# EAGLE design booz_imu_h (EAGLE 6.1)
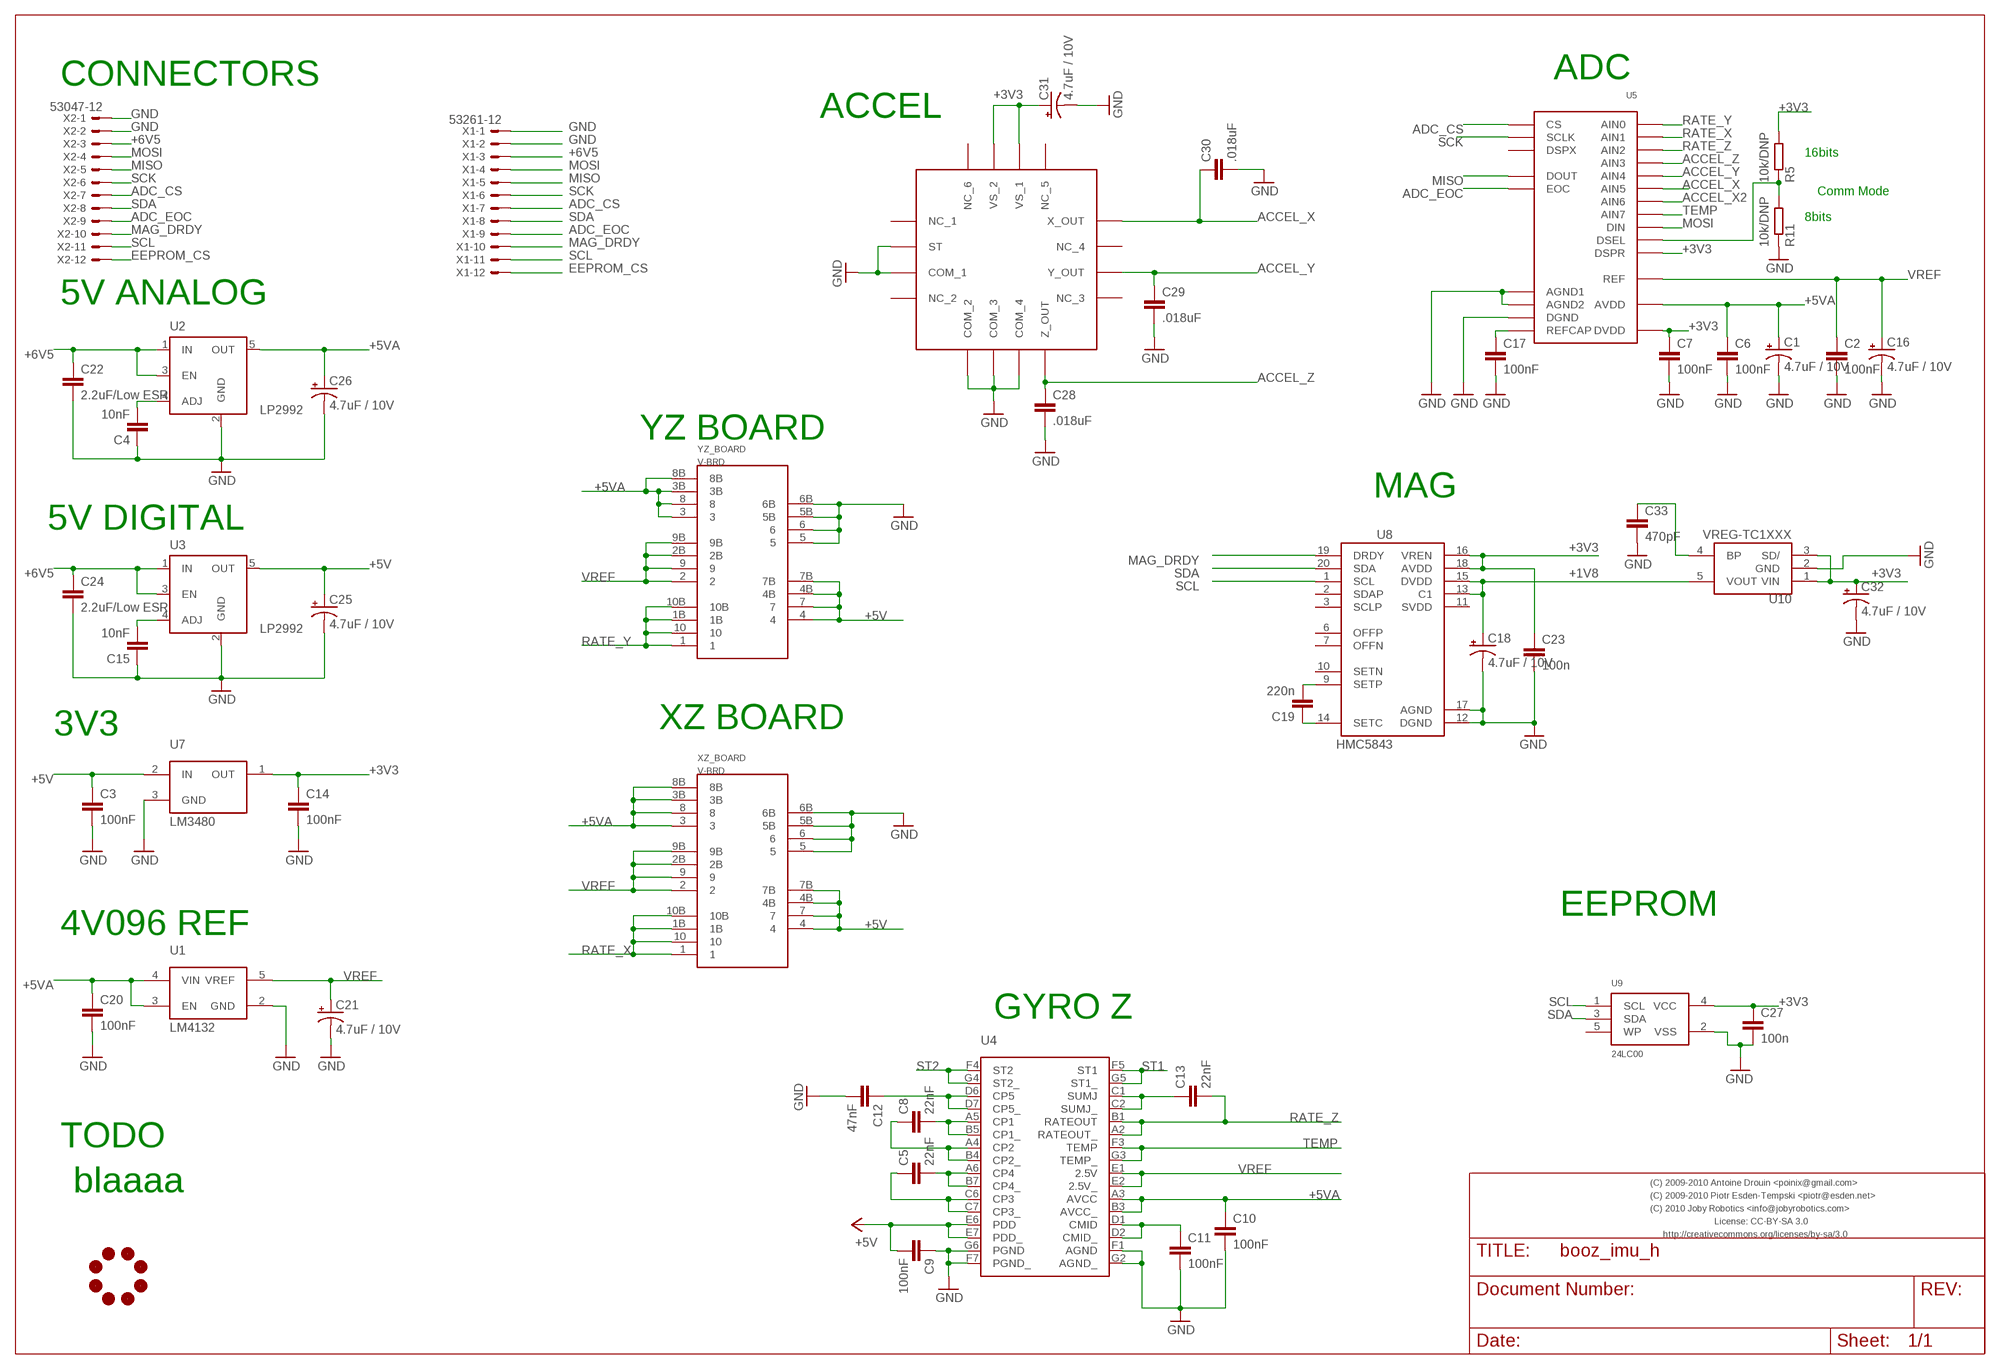
[diagram p0: schematic, sheet 1]

## Parts
C1  4.7uF / 10V  CPOL-US  [CAP_0805TANT_F95]
C2  100nF  CAPACITOR-0603  [0603-CAP]
C3  100nF  CAPACITOR-0603  [0603-CAP]
C4  10nF  CAPACITOR-0603  [0603-CAP]
C5  22nF  CAPACITOR-0603  [0603-CAP]
C6  100nF  CAPACITOR-0603  [0603-CAP]
C7  100nF  CAPACITOR-0603  [0603-CAP]
C8  22nF  CAPACITOR-0603  [0603-CAP]
C9  100nF  CAPACITOR-0603  [0603-CAP]
C10  100nF  CAPACITOR-0603  [0603-CAP]
C11  100nF  CAPACITOR-0603  [0603-CAP]
C12  47nF  CAPACITOR-0603  [0603-CAP]
C13  22nF  CAPACITOR-0603  [0603-CAP]
C14  100nF  CAPACITOR-0603  [0603-CAP]
C15  10nF  CAPACITOR-0603  [0603-CAP]
C16  4.7uF / 10V  CPOL-US  [CAP_0805TANT_F95]
C17  100nF  CAPACITOR-0603  [0603-CAP]
C18  4.7uF / 10V  CPOL-US  [CAP_0805TANT_F95]
C19  220n  CAPACITOR-0603  [0603-CAP]
C20  100nF  CAPACITOR-0603  [0603-CAP]
C21  4.7uF / 10V  CPOL-US  [CAP_0805TANT_F95]
C22  2.2uF/Low ESR  CAPACITOR-0603  [0603-CAP]
C23  100n  CAPACITOR-0603  [0603-CAP]
C24  2.2uF/Low ESR  CAPACITOR-0603  [0603-CAP]
C25  4.7uF / 10V  CPOL-US  [CAP_0805TANT_F95]
C26  4.7uF / 10V  CPOL-US  [CAP_0805TANT_F95]
C27  100n  CAPACITOR-0603  [0603-CAP]
C28  .018uF  CAPACITOR-0603  [0603-CAP]
C29  .018uF  CAPACITOR-0603  [0603-CAP]
C30  .018uF  CAPACITOR-0603  [0603-CAP]
C31  4.7uF / 10V  CPOL-US  [CAP_0805TANT_F95]
C32  4.7uF / 10V  CPOL-US  [CAP_0805TANT_F95]
C33  470pF  CAPACITOR-0603  [0603-CAP]
JL1  JOBY_LOGO-6MIL  [JOBY_LOGO_6MIL]
R5  10k/DNP  RESISTOR-0603  [0603-RES]
R11  10k/DNP  RESISTOR-0603  [0603-RES]
U1  LM4132  [SOT23-5L]
U2  LP2992  MIC5219BM5  [SOT23-5]
U3  LP2992  MIC5219BM5  [SOT23-5]
U4  ADXR  [BC-32]
U5  MAX1168  [QSOP24]
U6  ADXL335  [LFCSP_LQ16]
U7  LM3480  [SOT23]
U8  HMC5843  [LPCC20-HMC5843]
U9  24LC00  I2C_EEPROM-SOT23-5  [SOT23-5]
U10  VREG-TC1XXX  [SOT23-5]
X1  53261-12  [53261-12]
X2  53047-12  [53047-12]
XZ_BOARD  V-BRD  [V-BRD]
YZ_BOARD  V-BRD  [V-BRD]

## Nets
+1V8: C18.P$1(+) U8.13(C1) U8.15(DVDD) U10.5(VOUT)
+3V3: C7.P$1 C14.P$1 C23.P$1 C27.P$1 C31.P$1(+) C32.P$1(+) R5.P$2 U5.P$1(DSPR) U5.P$22(DVDD) U6.P$14(VS_1) U6.P$15(VS_2) U7.1(OUT) U8.16(VREN) U8.18(AVDD) U9.4(VCC) U10.1(VIN) U10.3(SD/)
+5V: C3.P$1 C9.P$2 C25.P$1(+) U3.5(OUT) U4.E6(PDD) U4.E7(PDD_) U7.2(IN) XZ_BOARD.4 XZ_BOARD.4B XZ_BOARD.7 XZ_BOARD.7B YZ_BOARD.4 YZ_BOARD.4B YZ_BOARD.7 YZ_BOARD.7B
+5VA: C1.P$1(+) C6.P$1 C10.P$1 C20.P$1 C26.P$1(+) U1.3(EN) U1.4(VIN) U2.5(OUT) U4.A3(AVCC) U4.B3(AVCC_) U5.P$19(AVDD) XZ_BOARD.3 XZ_BOARD.3B XZ_BOARD.8 XZ_BOARD.8B YZ_BOARD.3 YZ_BOARD.3B YZ_BOARD.8 YZ_BOARD.8B
+6V5: C22.P$1 C24.P$1 U2.1(IN) U2.3(EN) U3.1(IN) U3.3(EN) X1.3 X2.3
ACCEL_X: C30.P$1 U5.P$12(AIN5) U6.P$12(X_OUT)
ACCEL_X2: U5.P$13(AIN6)
ACCEL_Y: C29.P$1 U5.P$11(AIN4) U6.P$10(Y_OUT)
ACCEL_Z: C28.P$1 U5.P$10(AIN3) U6.P$8(Z_OUT)
ADC_CS: U5.P$20(CS) X1.7 X2.7
ADC_EOC: U5.P$6(EOC) X1.9 X2.9
EEPROM_CS: X1.12 X2.12
GND: C1.P$2(-) C2.P$2 C3.P$2 C4.P$1 C6.P$2 C7.P$2 C9.P$1 C10.P$2 C11.P$2 C12.P$2 C14.P$2 C15.P$1 C16.P$2(-) C17.P$2 C18.P$2(-) C20.P$2 C21.P$2(-) C22.P$2 C23.P$2 C24.P$2 C25.P$2(-) C26.P$2(-) C27.P$2 C28.P$2 C29.P$2 C30.P$2 C31.P$2(-) C32.P$2(-) C33.P$2 R11.P$1 U1.2(GND) U2.2(GND) U3.2(GND) U4.F1(AGND) U4.F7(PGND_) U4.G2(AGND_) U4.G6(PGND) U5.P$17(AGND1) U5.P$18(AGND2) U5.P$21(DGND) U6.P$2(ST) U6.P$3(COM_1) U6.P$5(COM_2) U6.P$6(COM_3) U6.P$7(COM_4) U7.3(GND) U8.12(DGND) U8.17(AGND) U9.2(VSS) U10.2(GND) X1.1 X1.2 X2.1 X2.2 XZ_BOARD.5 XZ_BOARD.5B XZ_BOARD.6 XZ_BOARD.6B YZ_BOARD.5 YZ_BOARD.5B YZ_BOARD.6 YZ_BOARD.6B
MAG_DRDY: U8.19(DRDY) X1.10 X2.10
MISO: U5.P$3(DOUT) X1.5 X2.5
MOSI: U5.P$5(DIN) X1.4 X2.4
N$1: R5.P$1 R11.P$2 U5.P$2(DSEL)
N$3: C17.P$1 U5.P$16(REFCAP)
N$5: C33.P$1 U10.4(BP)
N$7: C5.P$2 U4.A6(CP4) U4.B7(CP4_)
N$8: C5.P$1 U4.C6(CP3) U4.C7(CP3_)
N$9: C8.P$2 U4.A5(CP1) U4.B5(CP1_)
N$10: C8.P$1 U4.A4(CP2) U4.B4(CP2_)
N$11: C13.P$1 U4.C1(SUMJ) U4.C2(SUMJ_)
N$12: C12.P$1 U4.D6(CP5) U4.D7(CP5_)
N$13: C11.P$1 U4.D1(CMID) U4.D2(CMID_)
N$15: C19.P$2 U8.9(SETP)
N$19: C15.P$2 U3.4(ADJ)
N$23: C4.P$2 U2.4(ADJ)
N$48: C19.P$1 U8.14(SETC)
RATE_X: U5.P$8(AIN1) XZ_BOARD.1 XZ_BOARD.1B XZ_BOARD.10 XZ_BOARD.10B
RATE_Y: U5.P$7(AIN0) YZ_BOARD.1 YZ_BOARD.1B YZ_BOARD.10 YZ_BOARD.10B
RATE_Z: C13.P$2 U4.A2(RATEOUT_) U4.B1(RATEOUT) U5.P$9(AIN2)
SCK: U5.P$4(SCLK) X1.6 X2.6
SCL: U8.1(SCL) U9.1(SCL) X1.11 X2.11
SDA: U8.20(SDA) U9.3(SDA) X1.8 X2.8
ST1: U4.F5(ST1) U4.G5(ST1_)
ST2: U4.F4(ST2) U4.G4(ST2_)
TEMP: U4.F3(TEMP) U4.G3(TEMP_) U5.P$14(AIN7)
VREF: C2.P$1 C16.P$1(+) C21.P$1(+) U1.5(VREF) U4.E1(2.5V) U4.E2(2.5V_) U5.P$15(REF) XZ_BOARD.2 XZ_BOARD.2B XZ_BOARD.9 XZ_BOARD.9B YZ_BOARD.2 YZ_BOARD.2B YZ_BOARD.9 YZ_BOARD.9B
Unconnected: U5.P$23(DSPX) U6.P$1(NC_1) U6.P$4(NC_2) U6.P$9(NC_3) U6.P$11(NC_4) U6.P$13(NC_5) U6.P$16(NC_6) U8.2(SDAP) U8.3(SCLP) U8.6(OFFP) U8.7(OFFN) U8.10(SETN) U8.11(SVDD) U9.5(WP)

## Notes on the sheet
- CONNECTORS | ADC
- ACCEL
- 16bits
- Comm Mode
- 8bits
- 5V ANALOG
- YZ BOARD
- MAG
- 5V DIGITAL
- 3V3 | XZ BOARD
- EEPROM
- 4V096 REF
- GYRO Z
- TODO
- (C) 2009-2010 Antoine Drouin <poinix@gmail.com>
- blaaaa
- (C) 2009-2010 Piotr Esden-Tempski <piotr@esden.net>
- (C) 2010 Joby Robotics <info@jobyrobotics.com>
- License: CC-BY-SA 3.0
- http://creativecommons.org/licenses/by-sa/3.0

## Library data of the parts
C1 C16 C18 C21 C25 C26 C31 C32 = booz_imu_h:CPOL-US: POLARIZED CAPACITOR, American symbol
C2-C15 C17 C19 C20 C22-C24 C27-C30 C33 = pel_dipol_comp:CAPACITOR
JL1 = aspirin:JOBY_LOGO
R5 R11 = pel_dipol_comp:RESISTOR
U1 = booz:LM4132: Precision LDO Voltage Reference
U2 U3 = v-reg-micrel:MIC5219BM5: VOLTAGE REGULATOR
U4 = paparazzi:ADXR
U5 = booz:MAX1168
U6 = joby_robotics:ADXL335
U7 = booz:LM3480
U8 = omc:HMC5843: Honeywell HMC5843 - 3-Axis Digital Magnetometer - 3-Axis Magnetoresistive Sensors and ASIC in a Single Package - Low Voltage Operations (2.5 to 3.3V) - I2C Interface
U9 = aspirin:I2C_EEPROM
U10 = booz_imu_h:VREG-TC1XXX
X1 X2 = con-molex:53?-12: CONNECTOR wire to board 1.25 mm (.049 inch) pitch header
XZ_BOARD YZ_BOARD = booz_imu_h:V-BRD

## Board
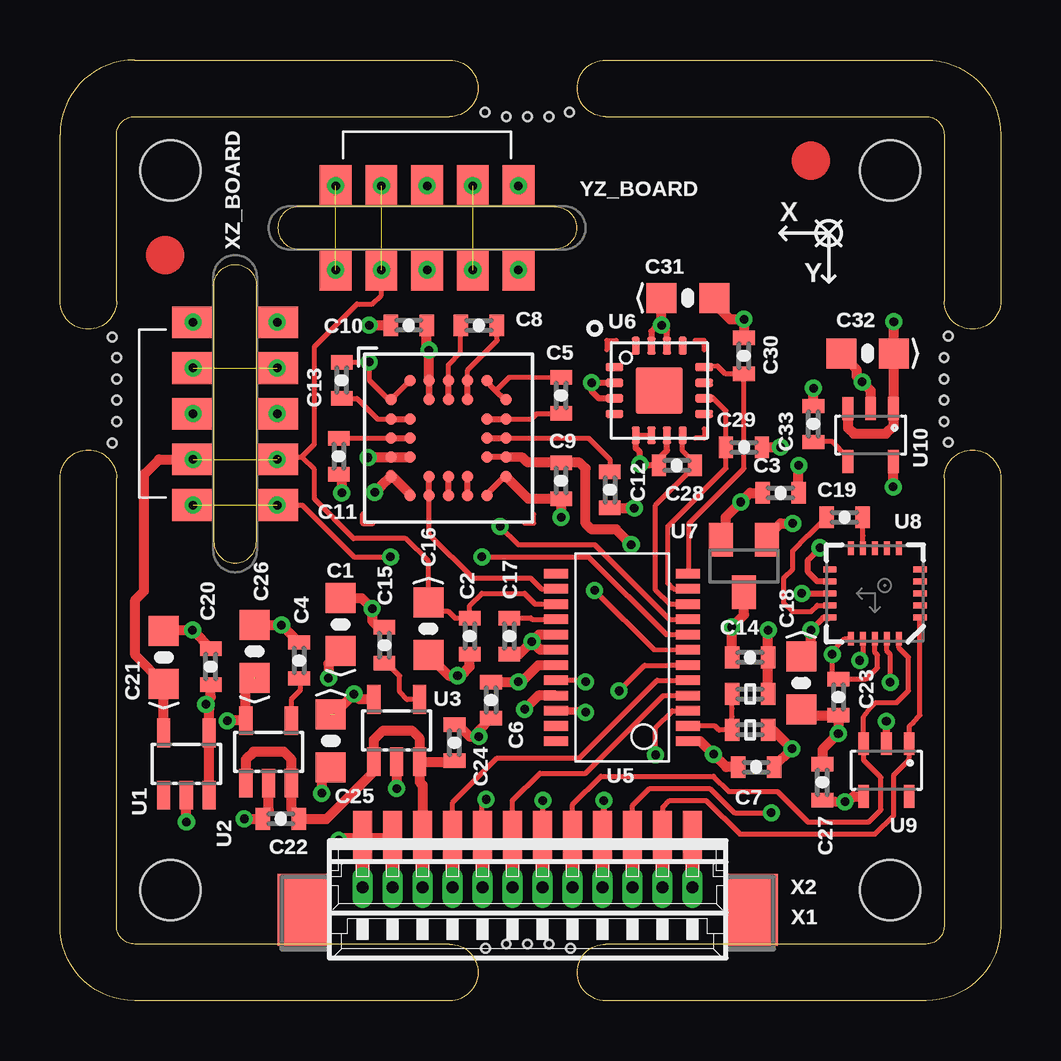
[diagram p1: board, top side]
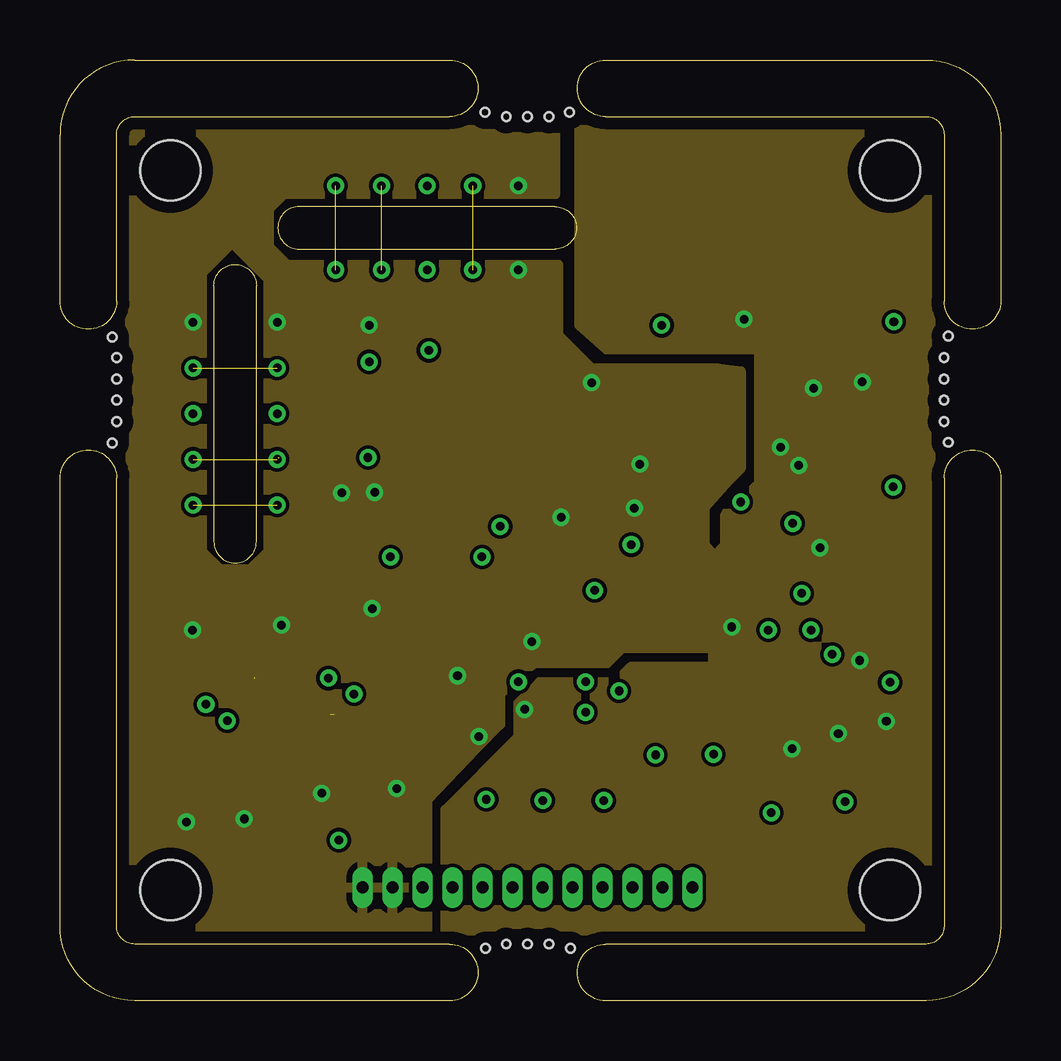
[diagram p2: board, inner layer Route2]
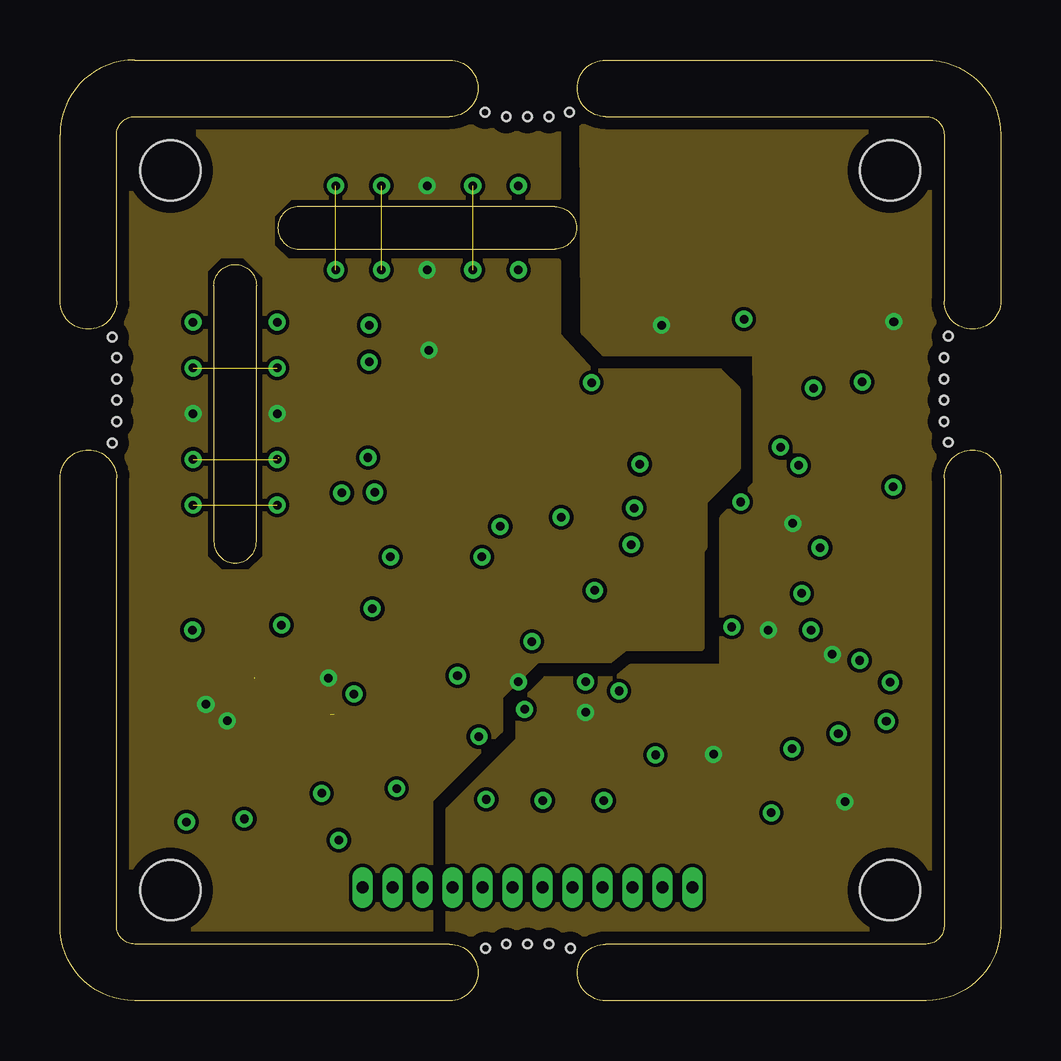
[diagram p3: board, inner layer Route15]
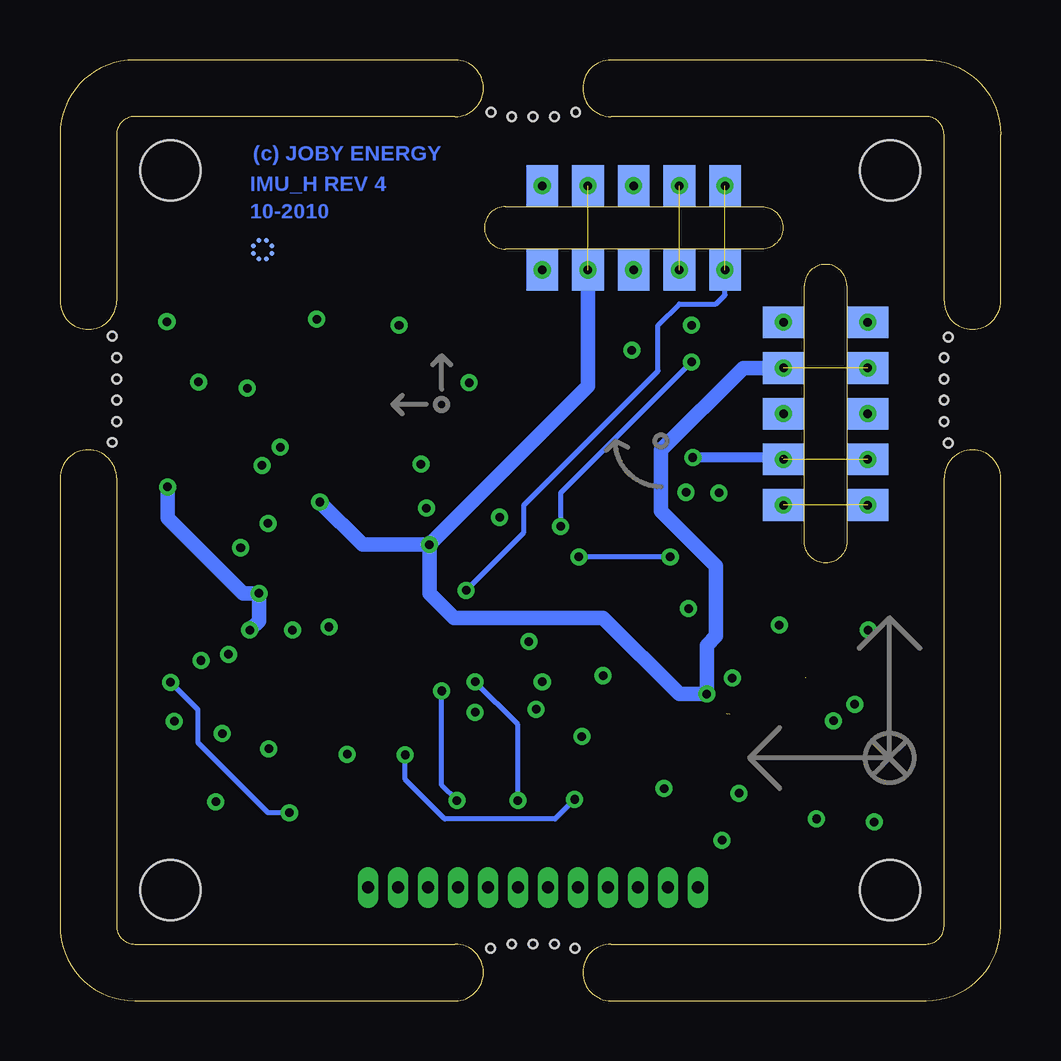
[diagram p4: board, bottom side, seen from below]

Size 39.22 x 39.22 mm. Coordinates in mm from the lower left corner, seen from the top.
Outline: 3.11,36.85 16.24,36.85 arc180 16.24,39.22 3.11,39.22 arc90 0,36.11 0,29.17 arc180 2.36,29.17 2.36,36.11 arc-90 3.11,36.85
Outline: 22.75,36.85 36.11,36.85 arc-90 36.86,36.11 36.86,29.17 arc180 39.22,29.17 39.22,36.11 arc90 36.11,39.22 22.75,39.22 arc180 22.75,36.85
Outline: 36.86,21.78 36.86,3.11 arc-90 36.11,2.36 22.75,2.36 arc180 22.75,0 36.11,0 arc90 39.22,3.11 39.22,21.78 arc180 36.86,21.78
Outline: 16.24,2.36 3.11,2.36 arc-90 2.36,3.11 2.36,21.78 arc180 0,21.78 0,3.11 arc90 3.11,0 16.24,0 arc180 16.24,2.36
Copper layers (1*2+15*16): Top 0.035mm / dielectric 0.2mm / Route2 0.035mm / dielectric 1.5mm / Route15 0.035mm / dielectric 0.2mm / Bottom 0.035mm
Design rules: minimum track width 0.15mm, minimum drill 0.35mm, track to track 0.15mm, track to pad 0.15mm, pad to pad 0.15mm, via to via 0.15mm, smd to smd 0.15mm, copper to edge 20mil, drill to drill 8mil, minimum pad ring 0.177mm, minimum via ring 0.177mm, stop-mask expansion 4mil, vias tented up to drill 14mil, thermal gap 10mil
Holes 2.5 mm at 4.61,34.61 34.61,34.61 34.61,4.61 4.61,4.61
Holes 0.36 mm at 2.36,24.14 2.18,27.67 2.18,23.25 36.86,24.14 37.03,23.28 37.03,27.7 19.49,2.36 17.74,2.18 21.27,2.18 19.49,36.86 21.25,37.03 17.72,37.03 2.36,25.03 2.36,25.92 2.36,26.81 36.86,25.03 36.86,25.92 36.86,26.81 20.38,36.86 18.61,36.86 20.38,2.36 18.61,2.36
tKeepout: area 2.1,32.1 to 7.1,37.1; area 32.1,32.1 to 37.1,37.1; area 2.1,2.1 to 7.1,7.1; area 32.1,2.1 to 37.1,7.1

### Footprints (pad centres in the part's own frame; a part is rotated, then mirrored left to right if it is on the bottom)
CAP_0805TANT_F95 = smd 1.25 x 1.25: P$1 -1.1,0; P$2 1.1,0
0603-CAP = smd 0.6 x 0.9: P$1 -0.75,0; P$2 0.75,0
JOBY_LOGO_6MIL = smd 0.203 x 0.203: 1 -0.152,0.381; 2 0.152,0.381; 3 0.381,0.152; 4 0.381,-0.152; 5 0.152,-0.381; 6 -0.152,-0.381; 7 -0.381,-0.152; 8 -0.381,0.152
0603-RES = smd 0.6 x 0.9: P$1 -0.75,0; P$2 0.75,0
SOT23-5L = smd 0.55 x 1.2: 1 -0.95,-1.3; 2 0,-1.3; 3 0.95,-1.3; 4 0.95,1.3; 5 -0.95,1.3
SOT23-5 = smd 0.55 x 1.2: 1 -0.95,-1.3; 2 0,-1.3; 3 0.95,-1.3; 4 0.95,1.3; 5 -0.95,1.3
BC-32 = smd 0.48 x 0.48: A2 -1.6,2.4; A3 -0.8,2.4; A4 0,2.4; A5 0.8,2.4; A6 1.6,2.4; B1 -2.4,1.6; B3 -0.8,1.6; B4 0,1.6; B5 0.8,1.6; B7 2.4,1.6; C1 -2.4,0.8; C2 -1.6,0.8; C6 1.6,0.8; C7 2.4,0.8; D1 -2.4,0; D2 -1.6,0; D6 1.6,0; D7 2.4,0; E1 -2.4,-0.8; E2 -1.6,-0.8; E6 1.6,-0.8; E7 2.4,-0.8; F1 -2.4,-1.6; F3 -0.8,-1.6; F4 0,-1.6; F5 0.8,-1.6; F7 2.4,-1.6; G2 -1.6,-2.4; G3 -0.8,-2.4; G4 0,-2.4; G5 0.8,-2.4; G6 1.6,-2.4
QSOP24 = smd 0.4 x 1: P$1 -3.493,-2.75; P$2 -2.857,-2.75; P$3 -2.223,-2.75; P$4 -1.587,-2.75; P$5 -0.953,-2.75; P$6 -0.318,-2.75; P$7 0.318,-2.75; P$8 0.953,-2.75; P$9 1.587,-2.75; P$10 2.223,-2.75; P$11 2.857,-2.75; P$12 3.493,-2.75; P$13 3.493,2.75; P$14 2.857,2.75; P$15 2.223,2.75; P$16 1.587,2.75; P$17 0.953,2.75; P$18 0.318,2.75; P$19 -0.318,2.75; P$20 -0.953,2.75; P$21 -1.587,2.75; P$22 -2.223,2.75; P$23 -2.857,2.75; P$24 -3.493,2.75
LFCSP_LQ16 = smd 0.75 x 0.35: P$1 -1.869,0.975; P$2 -1.869,0.325; P$3 -1.869,-0.325; P$4 -1.869,-0.975; P$9 1.869,-0.975; P$10 1.869,-0.325; P$11 1.869,0.325; P$12 1.869,0.975 | smd 0.35 x 0.75: P$5 -0.975,-1.869; P$6 -0.325,-1.869; P$7 0.325,-1.869; P$8 0.975,-1.869; P$13 0.975,1.869; P$14 0.325,1.869; P$15 -0.325,1.869; P$16 -0.975,1.869 | smd 1.95 x 1.95: P$17 0,0
SOT23 = smd 1 x 1.4: 1 -0.95,-1.1; 2 0.95,-1.1; 3 0,1.1
LPCC20-HMC5843 = smd 0.25 x 0.56: 1 1,1.88; 2 0.5,1.88; 3 0,1.88; 4 -0.5,1.88; 5 -1,1.88; 11 -1,-1.88; 12 -0.5,-1.88; 13 0,-1.88; 14 0.5,-1.88; 15 1,-1.88 | smd 0.56 x 0.25: 6 -1.88,1; 7 -1.88,0.5; 8 -1.88,0; 9 -1.88,-0.5; 10 -1.88,-1; 16 1.88,-1; 17 1.88,-0.5; 18 1.88,0; 19 1.88,0.5; 20 1.88,1
SOT23-5' = smd 0.45 x 0.95: 1 0.95,1.1; 2 0,1.1; 3 -0.95,1.1; 4 -0.95,-1.1; 5 0.95,-1.1
53261-12 = smd 0.8 x 2: 1 6.875,-2.5; 2 5.625,-2.5; 3 4.375,-2.5; 4 3.125,-2.5; 5 1.875,-2.5; 6 0.625,-2.5; 7 -0.625,-2.5; 8 -1.875,-2.5; 9 -3.125,-2.5; 10 -4.375,-2.5; 11 -5.625,-2.5; 12 -6.875,-2.5 | smd 2.1 x 3: S1 9.375,0.625; S2 -9.375,0.625
53047-12 = drill 0.5 pad 0.698 long: 1 6.875,0.45; 2 5.625,0.45; 3 4.375,0.45; 4 3.125,0.45; 5 1.875,0.45; 6 0.625,0.45; 7 -0.625,0.45; 8 -1.875,0.45; 9 -3.125,0.45; 10 -4.375,0.45; 11 -5.625,0.45; 12 -6.875,0.45
V-BRD = smd 1.321 x 1.727: 1 -3.81,-1.753; 2 -1.905,-1.753; 3 0,-1.753; 4 1.905,-1.753; 5 3.81,-1.753; 6 3.81,1.753; 7 1.905,1.753; 8 0,1.753; 9 -1.905,1.753; 10 -3.81,1.753 | smd 1.321 x 1.727 bottom: 1B -3.81,-1.753; 2B -1.905,-1.753; 3B 0,-1.753; 4B 1.905,-1.753; 5B 3.81,-1.753; 6B 3.81,1.753; 7B 1.905,1.753; 8B 0,1.753; 9B -1.905,1.753; 10B -3.81,1.753

### Placement (x,y rotation side)
C1  11.7,15.68 90 top
C2  17.08,15.2 270 top
C3  30.04,21.17 0 top
C4  9.97,14.19 270 top
C5  20.89,25.23 90 top
C6  17.97,12.53 270 top
C7  29.02,9.74 0 top
C8  17.46,28.16 0 top
C9  20.89,21.68 90 top
C10  14.54,28.16 180 top
C11  11.62,22.69 270 top
C12  22.92,21.3 270 top
C13  11.75,25.87 90 top
C14  28.77,14.31 180 top
C15  13.53,14.82 270 top
C16  15.35,15.51 270 top
C17  18.73,15.2 270 top
C18  30.9,13.25 270 top
C19  32.7,20.15 0 top
C20  6.29,13.93 90 top
C21  4.33,14.31 90 top
C22  9.21,7.58 180 top
C23  32.45,12.66 270 top
C24  16.45,10.76 90 top
C25  11.29,10.83 270 top
C26  8.12,14.57 90 top
C27  31.78,9.11 90 top
C28  25.72,22.31 180 top
C29  28.51,23.08 0 top
C30  28.51,26.89 90 top
C31  26.17,29.3 0 top
C32  33.67,26.99 180 top
C33  31.41,24.04 90 top
JL1  30.77,31.31 0 bottom
R5  28.77,12.79 0 top
R11  28.77,11.29 180 top
U1  5.27,9.87 0 top
U2  8.7,10.38 0 top
U3  14.03,11.26 0 top
U4  16.19,23.46 0 top
U5  23.43,14.31 90 top
U6  24.98,25.44 0 top
U7  28.51,18.12 180 top
U8  33.97,16.98 270 top
U9  24LC00  [SOT23-5']  34.45,9.61 0 top
U10  VREG-TC1XXX  [SOT23-5']  33.79,23.58 0 top
X1  19.49,4.41 180 top
X2  19.49,5.17 180 top
XZ_BOARD  7.3,24.47 90 top
YZ_BOARD  15.3,32.22 0 top

### Tracks (layer width: path | path; a pad name or v marks a point on that pad's centre or on a via)
+1V8  (via drill 0.36)
  Top 0.254: v30.92,16.98 U8.13 | U8.15 32.08,15.96 31.81,15.96 v31.31,15.46
  Top 0.406: C18.P$1 30.9,14.41 31.31,14.82 v31.31,15.46 | U10.5 34.74,21.43 v34.73,21.42
  Bottom 0.61: v31.31,15.46 30.92,15.84 v30.92,16.98 31.58,16.98 34.73,20.13 v34.73,21.42
+3V3  (via drill 0.36)
  Top 0.203: U8.18 33.97,14.52 34.07,14.41 34.07,13.88 33.62,13.42 C23.P$1 32.45,13.42 32.19,13.68 v32.19,14.44 32.19,14.57 32.73,15.1 U8.16
  Top 0.254: U6.P$15 24.65,27.62 24.65,27.9 24.9,28.16 v25.08,28.16 25.16,28.09 25.17,28.09 25.31,27.95 U6.P$14
  Top 0.305: U5.P$22 21.72,12.09 v21.91,12.03
  Top 0.406: 26.16,10.82 U5.P$1 26.7,10.82 v27.24,10.27 27.77,9.74 C7.P$1 | U9.4 33.08,8.52 32.85,8.29 v32.72,8.29 32.59,8.29 C27.P$1 | U7.1 29.46,19.33 30.04,19.9 v30.54,19.9 | v29.53,15.46 29.52,15.44 C14.P$1 R5.P$2 | v25.08,28.16 25.08,29.29 C31.P$1 | U10.3 32.84,23.87 33.08,23.63 34.43,23.63 34.76,23.96 34.76,24.67 U10.1 34.77,24.68 C32.P$1 v34.77,28.3 v34.76,28.31
  pour Route15: 16.19,2.12 16.19,7.96 19.11,10.88 19.11,12.28 20.26,13.42 23.18,13.42 23.81,13.93 27.62,13.93 27.62,20.15 29.02,21.55 29.02,25.11 28.99,26.99 22.67,26.99 21.83,27.85 21.78,37.05 37.02,37.05 37.02,2.12
  pour Route15: 6.03,30.44 6.67,31.08 7.94,31.08 7.94,36.92 5.78,36.92 5.78,30.44
+5V  (via drill 0.36)  (3 unrouted)
  Top 0.254: U4.E7 U4.E6
  Top 0.406: U4.E7 19.29,22.64 19.49,22.44 C9.P$2 21.67,22.43 21.91,22.19 21.91,19.9 22.16,19.65 23.18,19.65 v23.81,19.01 | 11.43,11.96 v12.26,12.79 12.47,12.57 U3.5 | U7.2 27.56,19.46 27.75,19.65 27.75,20.15 v28.38,20.79 28.77,21.17 C3.P$1
  Bottom 0.61: v23.81,19.01 26.61,19.01 v28.38,20.79 | v23.81,19.01 17.21,25.62 YZ_BOARD.4B | v23.81,19.01 23.81,16.98 22.8,15.96 16.57,15.96 13.4,12.79 v12.26,12.79 12.26,14.82 11.87,15.2 11.87,18.12 14.16,20.41 14.16,22.95 10.73,26.38 XZ_BOARD.4B
  other vias: 9.06,26.38 5.55,26.38 17.21,30.47 17.21,33.97
+5VA  (via drill 0.36)  (1 unrouted)
  Top 0.254: U4.B3 U4.A3 15.39,25.15 15.43,25.11 U4.B3
  Top 0.406: U1.3 U1.4 6.22,12.17 v6.08,12.36 6.29,12.66 C20.P$1 | U5.P$19 19.94,13.99 19.24,13.3 v19.11,13.3 19.1,13.28 C6.P$1 | v6.97,11.67 v6.98,11.68 U2.5 7.75,13.1 C26.P$1 | 8.13,13.49 8.13,13.48 | C10.P$1 15.29,27.2 v15.38,27.11 15.39,27.1 U4.A3 | C1.P$1 11.7,14.57 11.19,14.06 v11.19,13.45
  other vias: 15.3,30.47 15.3,33.97 5.55,24.47 9.06,24.47
  pour Route15: 2.1,37.05 6.03,37.05 6.03,18.5 6.67,17.87 7.94,17.87 8.57,18.5 8.57,30.19 7.68,31.08 7.68,37.05 20.76,37.05 20.76,33.49 9.59,33.49 8.83,32.73 8.83,31.46 9.46,30.82 20.76,30.82 20.76,27.77 22.16,26.25 27.5,26.25 28.26,25.49 28.26,22.19 26.86,20.79 26.86,18.88 26.73,18.76 26.73,14.69 23.56,14.69 22.92,14.19 19.88,14.19 18.35,12.66 18.35,11.26 15.43,8.34 15.43,2.12 2.1,2.12
+6V5
  Top 0.406: U2.1 7.75,10.06 8.06,10.38 9.33,10.38 9.65,10.06 U2.3 9.65,8.01 C22.P$1 11.11,7.58 13.08,9.55 U3.1 13.09,10.89 13.47,11.26 14.67,11.26 14.98,10.95 U3.3 15,9.95 | X1.3 15.12,8.98 15,9.11 15,9.95 | 15,9.95 16.39,9.95 C24.P$1
  Top 0.61: X1.3 X2.3
ACCEL_X
  Top 0.203: U6.P$12 27.41,26.46 27.75,26.12 28,26.12 C30.P$1 28.51,26 28.52,25.98 28.51,25.88 28.51,22.19 26.23,19.9 26.23,17.85 U5.P$12
ACCEL_Y
  Top 0.203: U6.P$10 27.19,25.16 27.76,24.59 C29.P$1 27.76,22.2 25.34,19.77 25.34,17.41 25.58,17.17 U5.P$11
ACCEL_Z
  Top 0.203: U6.P$8 25.96,22.91 26.48,22.39 C28.P$1 24.83,20.66 24.83,17.11 25.4,16.53 U5.P$10
ADC_CS  (via drill 0.36)
  Top 0.203: X1.7 v20.13,8.34 | U5.P$20 21.84,13.36 v21.91,13.3
  Top 0.254: X1.7
  Top 0.61: X2.7 X1.7
  Bottom 0.203: v21.91,13.3 20.13,11.52 v20.13,8.34
ADC_EOC  (via drill 0.36)
  Top 0.203: v23.3,12.92 24.37,13.98 25.39,13.98 25.4,13.99 U5.P$6 | 22.62,4.79 22.62,7.4
  Top 0.254: 22.62,7.4 22.64,7.43 22.67,8.09 v22.67,8.34
  Top 0.61: 22.62,4.61 X2.9 22.62,4.79 X1.9
  Bottom 0.203: v22.67,8.34 23.3,8.98 v23.3,12.92
EEPROM_CS
  Top 0.61: X2.12 X1.12
GND  (via drill 0.36)
  Top 0.203: U8.17 33.47,14.32 v33.34,14.19
  Top 0.254: 17.73,21.06 17.72,21.04 | U4.G6 17.73,21.06 | 13.78,21.93 13.79,21.92 U4.F1 | 14.59,21.12 U4.G2 | 17.73,21.06 18.53,21.86 U4.F7 | C20.P$2 6.27,14.81 | U6.P$2 v22.16,25.77 22.16,25.41 22.47,25.11 U6.P$3 | U6.P$6 U6.P$5 24.01,23.03 24.17,22.87 v24.17,22.36 24.33,22.31 C28.P$2 24.98,22.33 24.98,22.62 25.31,22.94 U6.P$7 | U8.12 31.57,17.48 31.18,17.87 31.18,18.38 v31.69,18.88
  Top 0.305: U9.2 v34.45,11.65
  Top 0.406: 13.79,21.92 14.59,21.12 | v5.27,7.45 U1.2 | C20.P$2 v5.52,15.46 4.33,15.46 C21.P$2 | U2.2 8.7,7.95 C22.P$2 v7.68,7.58 | U4.F1 13.39,21.45 v13.12,21.2 | v20.89,20.15 C9.P$1 19.52,20.93 U4.F7 | C29.P$2 v30.04,23.08 | U5.P$21 19.94,12.73 v19.37,12.15 | U5.P$17 19.96,15.27 v19.67,14.97 | U5.P$18 20.02,14.63 v19.67,14.97 | C17.P$2 19.15,14.45 v19.67,14.97 | C2.P$2 17.08,13.93 16.7,13.55 v16.57,13.55 16.21,13.55 C16.P$2 | C15.P$1 13.28,15.57 13.02,15.84 v13.02,16.34 | v13.02,16.34 12.96,16.41 | C4.P$1 v9.23,15.66 v9.23,15.67 C26.P$2 | C12.P$2 23.67,20.55 v23.94,20.54 | C30.P$2 v28.51,28.41 27.93,28.41 27.27,29.06 C31.P$2 | v12.89,28.16 C10.P$2 | C11.P$2 11.62,21.93 11.75,21.81 v11.75,21.17 | C6.P$2 17.46,11.26 v17.46,11.01 17.08,11.01 16.59,11.51 C24.P$2 | U3.2 v14.03,8.85 | C7.P$2 29.77,9.76 v30.51,10.5 29.77,11.24 R11.P$1 | C27.P$2 31.78,10.47 v32.45,11.14 C23.P$2 32.44,11.9 31.23,11.9 30.98,12.15 C18.P$2 | C3.P$2 30.79,22.3 v30.8,22.31 | U7.3 28.51,16.09 v28,15.58 28.02,15.57 C14.P$2 | U10.2 33.79,25.44 v33.44,25.79 33.21,26.02 33.21,26.3 32.57,26.94 C32.P$2 | C33.P$2 v31.41,25.54 | C1.P$2 12.58,16.78 v13.02,16.34 | C25.P$2 10.91,9.36 v10.91,8.65
  Top 0.61: X2.2 X1.2 13.91,6.95 | X2.1 X1.1
  other vias: 19.11,33.97 19.11,30.47 5.55,28.28 9.06,28.28
  pour Route2 (rank 2): 6.92,37.05 20.64,37.05 20.64,33.62 9.33,33.62 8.7,32.98 8.7,31.46 9.46,30.7 20.76,30.7 20.76,27.77 22.16,26.38 27.37,26.38 28.38,26.25 28.38,22.19 27.88,21.68 26.86,20.54 26.86,19.01 27.24,18.63 27.24,14.69 23.43,14.69 22.8,14.06 19.75,14.06 18.35,12.79 18.35,11.52 17.34,10.5 15.3,8.34 15.3,2.12 2.35,2.12 2.35,37.05 6.03,37.05 5.91,30.95 5.91,18.76 6.67,18 7.94,18 8.7,18.76 8.7,30.06 6.92,31.84
  pour Route2: 16.07,2.12 16.07,7.96 19.11,11.01 19.11,12.41 20,13.3 23.18,13.3 23.81,13.93 27.24,13.93 27.24,18.5 27.75,19.01 27.75,20.28 29.15,21.55 29.15,27.14 22.8,27.14 21.65,28.16 21.65,37.05 36.89,37.05 36.89,2.12
  pour Route2: 2.35,36.79 7.3,36.79 7.3,31.71 5.91,30.31 2.35,30.31
MAG_DRDY  (via drill 0.36)
  Top 0.203: 23.87,4.97 23.87,8.15 24.57,8.85 27.09,8.85 28.11,7.84 v29.65,7.84 | v34.61,13.27 34.61,14.44 34.47,14.57 U8.19
  Top 0.61: X1.10 23.87,4.97 X2.10
  Bottom 0.203: v29.65,7.84 30.54,7.84 33.46,10.76 33.46,12.13 v34.61,13.27
MISO  (via drill 0.36)
  Top 0.203: 17.59,6.3 17.59,8.22 v17.77,8.39 | U5.P$3 25.53,12.09 24.83,11.39 v24.83,10.25
  Top 0.254: 17.59,6.3 arc90 X1.5
  Top 0.61: X2.5 17.62,6.27 17.59,6.3
  Bottom 0.203: v17.77,8.39 18.58,7.58 23.18,7.58 24.83,9.23 v24.83,10.25
MOSI
  Top 0.203: U5.P$5 24.89,13.36 21.65,10.12 18.22,10.12 16.37,8.27 X1.4
  Top 0.61: X2.4 X1.4
N$1
  Top 0.203: U5.P$2 27.31,11.45 27.47,11.29 R11.P$2 28.01,11.85 28.01,12.17 R5.P$1
N$3
  Top 0.203: U5.P$16 19.68,15.9 19.62,15.96 18.74,15.96 C17.P$1
N$5
  Top 0.203: U10.4 32.84,22.65 32.19,23.3 31.42,23.3 C33.P$1
N$7
  Top 0.203: 18.16,25.42 18.73,26 19.64,26 C5.P$2
  Top 0.254: 17.73,25.86 17.72,25.87 | 17.73,25.86 U4.A6 | U4.B7 18.53,25.06 18.16,25.42 17.73,25.86
N$8
  Top 0.203: C5.P$1 20.26,24.47 19.88,24.47 19.66,24.26 U4.C7
  Top 0.254: U4.C7 U4.C6 17.75,24.26 17.72,24.22
N$9
  Top 0.203: U4.A5 16.99,26.29 18.22,27.52 18.22,28.14 C8.P$2
  Top 0.254: U4.A5 U4.B5 16.99,25.02 16.95,24.98
N$10
  Top 0.203: U4.A4 16.19,26.5 16.7,27.01 16.7,28.14 C8.P$1
  Top 0.254: 16.19,25.87 U4.A4 U4.B4
N$11
  Top 0.203: U4.C1 13.23,24.26 12.38,25.11 C13.P$1
  Top 0.254: U4.C1 U4.C2
N$12
  Top 0.203: C12.P$1 22.92,22.57 22.03,23.46 U4.D7
  Top 0.254: 17.72,23.46 U4.D6 U4.D7
N$13
  Top 0.203: U4.D1 11.63,23.46 C11.P$1
  Top 0.254: 13.78,23.46 U4.D1 U4.D2
N$15
  Top 0.203: C19.P$2 33.46,20.02 33.46,19.39 33.47,19.38 U8.9
N$18  (via drill 0.36)
  Top 0.61: v11.62,6.69 13.78,6.69
N$19
  Top 0.203: C15.P$2 13.64,14.07 14.16,13.55 14.16,12.89 14.47,12.56 U3.4
N$23
  Top 0.203: U2.4 9.66,12.59 10.03,12.95 10.03,13.37 C4.P$2
N$29
  Top 0.203: 26.48,23.46 26.86,23.46 26.86,23.84
N$30
  Top 0.203: 26.48,27.52 26.86,27.52 26.86,27.14
N$31
  Top 0.203: 23.18,27.52 22.8,27.52 22.8,27.14
N$34
  Top 0.254: 12.64,20.28 12.64,19.9 13.02,19.9
N$35
  Top 0.203: 19.75,20.28 19.75,19.9 19.37,19.9
N$48
  Top 0.203: U8.14 31.57,16.48 31.31,16.22 30.54,16.22 30.16,16.6 30.16,17.61 30.54,18 30.54,18.76 31.18,19.39 31.19,19.39 C19.P$1
RATE_X  (via drill 0.36)  (1 unrouted)
  Top 0.203: U5.P$8 25.27,15.27 22.03,18.5 v17.59,18.5 | v13.78,18.5 12.26,18.5 10.1,20.66 XZ_BOARD.1
  Bottom 0.203: v13.78,18.5 v17.59,18.5
  other vias: 9.06,20.66 5.55,20.66
RATE_Y  (via drill 0.36)  (1 unrouted)
  Top 0.203: U5.P$7 25.81,14.63 24.75,14.64 v22.29,17.11
  Bottom 0.203: v22.29,17.11 19.88,19.52 19.88,20.66 14.29,26.25 14.29,28.16 13.4,29.04 11.87,29.04 11.49,29.43 YZ_BOARD.1B
  other vias: 11.49,33.97 11.49,30.47
RATE_Z  (via drill 0.36)
  Top 0.203: U4.A2 U4.B1 13.7,25.06 12.89,25.87 v12.89,26.63 11.76,26.63 C13.P$2 | v18.35,19.77 19.11,19.01 22.29,19.01 25.4,15.9 U5.P$9
  Top 0.254: U4.B1 13.78,25.04 13.78,24.98
  Bottom 0.203: v18.35,19.77 18.35,21.17 v12.89,26.63
SCK
  Top 0.203: 18.86,7.2 18.86,8.34 20,9.49 21.91,9.49 25.15,12.73 U5.P$4 | X1.6 18.87,7.21
  Top 0.254: 18.87,7.21 18.86,7.2
  Top 0.61: X2.6 X1.6
SCL
  Top 0.203: U8.1 35.85,11.9 35.59,11.63 35.41,11.47 U9.1 35.4,10.06 34.75,9.41 34.75,7.73 33.97,6.95 28.33,6.95 26.94,8.34 25.41,8.34 25.13,8.06 25.13,6.92 X1.11
  Top 0.61: X2.11 X1.11
SDA
  Top 0.203: 21.37,7.04 21.37,8.19 22.54,9.36 27.24,9.36 27.88,8.72 29.91,8.72 31.18,7.45 33.72,7.45 34.23,7.96 34.23,9.3 33.51,10.02 33.51,10.2 U9.3 33.5,11.84 33.85,12.28 34,12.43 34.89,12.43 35.37,12.92 35.37,14.31 34.97,14.71 U8.20
  Top 0.61: X2.8 X1.8 21.37,7.04
ST1
  Top 0.254: 16.97,21.06 16.95,21.04 | U4.G5 16.97,21.06 | U4.F5 16.99,21.08 16.97,21.06
ST2
  Top 0.254: 16.19,21.04 U4.G4 U4.F4
TEMP
  Top 0.203: U5.P$14 20.07,17.17 19.62,17.61 17.21,17.61 15.39,19.43 U4.G3
  Top 0.254: U4.G3 U4.F3 15.39,21.89 15.43,21.93
VREF  (via drill 0.36)  (3 unrouted)
  Top 0.203: U5.P$15 19.81,16.53 19.37,16.98 17.59,16.98 17.08,16.47 17.09,15.96 C2.P$1 16.46,15.95 16.17,16.24 15.72,16.24 C16.P$1 15.35,18.32 15.36,18.32 14.41,19.27 12.23,19.27 10.6,20.92 10.6,22.14 10.1,22.64 | 10.1,22.64 9.13,22.64 XZ_BOARD.2B | 10.1,22.64 10.1,22.69 10.6,23.2 10.6,27.27 12.38,29.04 13.02,29.04 13.4,29.43 YZ_BOARD.2B
  Top 0.406: U4.E2 U4.E1 v12.85,22.66 v12.84,22.64 | XZ_BOARD.9B 4.13,22.57 3.51,21.95 3.51,17.08 3.14,16.71 3.14,14.41 C21.P$1 U1.5
  Bottom 0.406: 9.09,22.64 v12.84,22.64
  other vias: 5.55,22.57 9.06,22.57 13.4,30.47 13.4,33.97
(copper drawn outside any net)
  shapes: Top circle x2

### Text on the board
Bottom: (c) JOBY ENERGY | IMU_H REV 4 | 10-2010
tPlace: X | Y
tDocu: Quadrotor IMU v1.02 | 2009/05
bDocu: Quadrotor IMU v1.02 | 2009/05 | Ay | r | Ax | Y | Z | X | GND | GND | +6V5 | MOSI | MISO | SCK | ADC_CS | MAG_CS | ADC_EOC | MAG_DRDY | MAG_RESET | EE_CS
_tNames: YZ_BOARD | XZ_BOARD | C31 | C10 | C32 | C8 | U6 | C5 | C30 | C13 | C29 | C9 | C12 | C33 | U10 | C28 | C3 | C11 | C19 | C16 | U7 | U8 | C1 | C15 | C17 | C2 | C18 | C26 | C4 | C20 | C14 | C23 | C21 | U3 | C6 | C24 | C25 | U5 | C7 | U1 | U2 | C22 | U9 | C27 | X2 | X1
_tDocu: R5 | R11